# EAGLE design ramanPi_interfaceBoard (EAGLE 6.2)
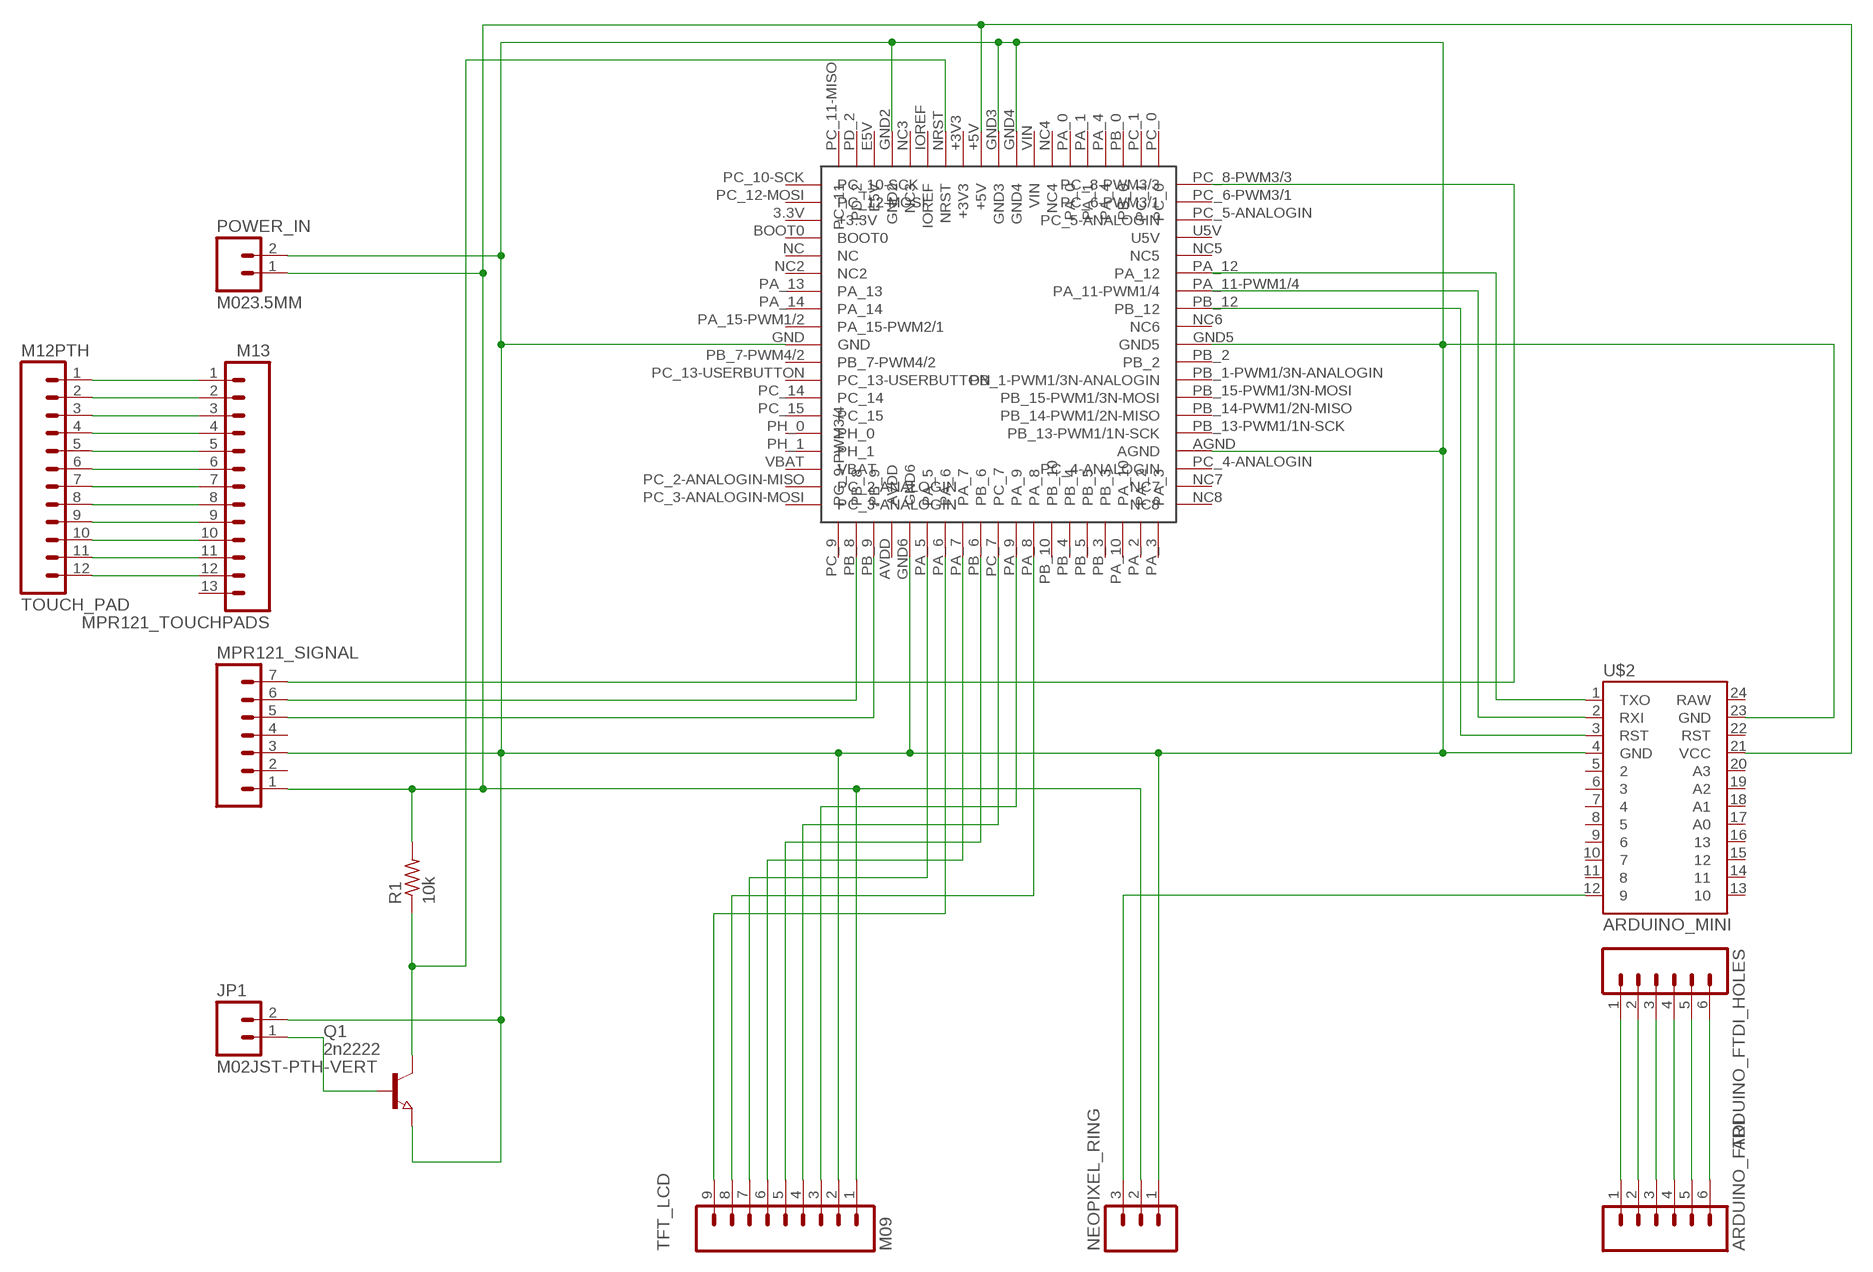
[diagram p0: schematic, sheet 1]

## Parts
ARDUINO_FTDI  M06SIP  [1X06]
ARDUINO_FTDI_HOLES  M06SIP  [1X06]
JP1  M02JST-PTH-VERT  [JST-2-PTH-VERT]
MPR121_SIGNAL  M07  [1X07]
MPR121_TOUCHPADS  M13  [1X13]
NEOPIXEL_RING  M03JST-PTH-VERT  [JST-3-PTH-VERT]
POWER_IN  M023.5MM  [SCREWTERMINAL-3.5MM-2]
Q1  2n2222  NPN-TRANSISTOR_SOT23  [SOT23]
R1  10k  R-US_M1206  [M1206]
TFT_LCD  M09  [1X09]
TOUCH_PAD  M12PTH  [1X12]
U$1  STNUCLEOF401RE  [F401-RE]
U$2  ARDUINO_MINI  [ARDUINO_MINI]

## Nets
+5V: MPR121_SIGNAL.1 NEOPIXEL_RING.2 POWER_IN.1 R1.2 TFT_LCD.1 U$1.+5V U$2.21(VCC)
GND: JP1.2 MPR121_SIGNAL.3 NEOPIXEL_RING.1 POWER_IN.2 Q1.2(E) TFT_LCD.2 U$1.AGND U$1.GND U$1.GND2 U$1.GND3 U$1.GND4 U$1.GND5 U$1.GND6 U$2.4(GND) U$2.23(GND)
N$2: MPR121_TOUCHPADS.1 TOUCH_PAD.1
N$3: MPR121_TOUCHPADS.2 TOUCH_PAD.2
N$4: MPR121_TOUCHPADS.3 TOUCH_PAD.3
N$5: MPR121_TOUCHPADS.4 TOUCH_PAD.4
N$6: MPR121_TOUCHPADS.5 TOUCH_PAD.5
N$7: MPR121_TOUCHPADS.6 TOUCH_PAD.6
N$8: MPR121_TOUCHPADS.7 TOUCH_PAD.7
N$9: MPR121_TOUCHPADS.8 TOUCH_PAD.8
N$10: MPR121_TOUCHPADS.9 TOUCH_PAD.9
N$11: MPR121_TOUCHPADS.10 TOUCH_PAD.10
N$12: MPR121_TOUCHPADS.11 TOUCH_PAD.11
N$13: MPR121_TOUCHPADS.12 TOUCH_PAD.12
N$14: NEOPIXEL_RING.3 U$2.12
N$15: MPR121_SIGNAL.7 U$1.PC_8-PWM3/3
N$16: MPR121_SIGNAL.5 U$1.PB_9
N$17: MPR121_SIGNAL.6 U$1.PB_8
N$18: ARDUINO_FTDI.1 ARDUINO_FTDI_HOLES.1
N$19: ARDUINO_FTDI.2 ARDUINO_FTDI_HOLES.2
N$20: ARDUINO_FTDI.3 ARDUINO_FTDI_HOLES.3
N$21: ARDUINO_FTDI.4 ARDUINO_FTDI_HOLES.4
N$22: ARDUINO_FTDI.5 ARDUINO_FTDI_HOLES.5
N$23: ARDUINO_FTDI.6 ARDUINO_FTDI_HOLES.6
N$24: TFT_LCD.3 U$1.PA_9
N$26: U$1.PA_12 U$2.1(TXO)
N$27: U$1.PA_11-PWM1/4 U$2.2(RXI)
N$28: U$1.PB_12 U$2.3(RST)
N$29: TFT_LCD.4 U$1.PC_7
N$30: TFT_LCD.5 U$1.PB_6
N$31: TFT_LCD.6 U$1.PA_7
N$32: TFT_LCD.7 U$1.PA_5
N$33: TFT_LCD.8 U$1.PA_8
N$34: TFT_LCD.9 U$1.PA_6
N$35: Q1.3(C) R1.1 U$1.NRST
N$36: JP1.1 Q1.1(B)
Unconnected: MPR121_SIGNAL.2 MPR121_SIGNAL.4 MPR121_TOUCHPADS.13 U$1.BOOT0 U$1.IOREF U$1.NC U$1.NC2 U$1.NC3 U$1.NC4 U$1.NC5 U$1.NC6 U$1.NC7 U$1.NC8 U$1.PA_0 U$1.PA_1 U$1.PA_2 U$1.PA_3 U$1.PA_4 U$1.PA_10 U$1.PA_13 U$1.PA_14 U$1.PA_15-PWM1/2(PA_15-PWM2/1) U$1.PB_0 U$1.PB_1-PWM1/3N-ANALOGIN U$1.PB_2 U$1.PB_3 U$1.PB_4 U$1.PB_5 U$1.PB_7-PWM4/2 U$1.PB_10 U$1.PB_13-PWM1/1N-SCK U$1.PB_14-PWM1/2N-MISO U$1.PB_15-PWM1/3N-MOSI U$1.PC_0 U$1.PC_1 U$1.PC_2-ANALOGIN-MISO(PC_2-ANALOGIN) U$1.PC_3-ANALOGIN-MOSI(PC_3-ANALOGIN) U$1.PC_4-ANALOGIN U$1.PC_5-ANALOGIN U$1.PC_6-PWM3/1 U$1.PC_9(PC_9-PWM3/4) U$1.PC_10-SCK U$1.PC_11-MISO(PC_11) U$1.PC_12-MOSI U$1.PC_13-USERBUTTON U$1.PC_14 U$1.PC_15 U$1.PD_2 U$1.PH_0 U$1.PH_1 U$2.5 U$2.6 U$2.7 U$2.8 U$2.9 U$2.10 U$2.11 U$2.13 U$2.14 U$2.15 U$2.16 U$2.17(A0) U$2.18(A1) U$2.19(A2) U$2.20(A3) U$2.22(RST) U$2.24(RAW)

## Power pins joined to a net without a drawn wire
+3.3V: U$1.3.3V(+3.3V)
+3V3: U$1.+3V3
AVDD: U$1.AVDD
E5V: U$1.E5V
U5V: U$1.U5V
VBAT: U$1.VBAT
VIN: U$1.VIN

## Library data of the parts
ARDUINO_FTDI ARDUINO_FTDI_HOLES = SparkFun-Connectors:M06: Header 6 Standard 6-pin 0.1" header. Use with straight break away headers (SKU : PRT-00116), right angle break away headers (PRT-00553), swiss pins (PRT-00743), machine pins (PRT-00117), and female headers (PRT-00115). Molex polarized connector foot print use with SKU : PRT-08094 with associated crimp pins and housings. NOTES ON THE VARIANTS LOCK and LOCK_LONGPADS... This footprint was designed to help hold the alignment of a through-hole component (i.e. 6-pin header) while soldering it into place. You may notice that each hole has been shifted either up or down by 0.005 of an inch from it's more standard position (which is a perfectly straight line). This slight alteration caused the pins (the squares in the middle) to touch the edges of the holes. Because they are alternating, it causes a "brace" to hold the component in place. 0.005 has proven to be the perfect amount of "off-center" position when using our standard breakaway headers. Although looks a little odd when you look at the bare footprint, once you have a header in there, the alteration is very hard to notice. Also,if you push a header all the way into place, it is covered up entirely on the bottom side. This idea of altering the position of holes to aid alignment will be further integrated into the Sparkfun Library for other footprints. It can help hold any component with 3 or more connection pins.
JP1 POWER_IN = SparkFun-Connectors:M02: Standard 2-pin 0.1" header. Use with - straight break away headers ( PRT-00116) - right angle break away headers (PRT-00553) - swiss pins (PRT-00743) - machine pins (PRT-00117) - female headers (PRT-00115) Molex polarized connector foot print use with: PRT-08233 with associated crimp pins and housings. 2.54_SCREWTERM for use with PRT-10571. 3.5mm Screw Terminal footprints for PRT-08084 5mm Screw Terminal footprints for use with PRT-08433
MPR121_SIGNAL = SparkFun-Connectors:M07: Header 7 Standard 7-pin 0.1" header. Use with straight break away headers (SKU : PRT-00116), right angle break away headers (PRT-00553), swiss pins (PRT-00743), machine pins (PRT-00117), and female headers (PRT-00115). NOTES ON THE VARIANTS LOCK and LOCK_LONGPADS... This footprint was designed to help hold the alignment of a through-hole component (i.e. 7-pin header) while soldering it into place. You may notice that each hole has been shifted either up or down by 0.005 of an inch from it's more standard position (which is usually a perfectly straight line). This slight alteration caused the pins (the squares in the middle) to touch the edges of the holes. Because they are alternating, it causes a "brace" to hold the header in place. 0.005 has proven to be the perfect amount of "off-center" position when using our standard breakaway headers. Although looks a little odd when you look at the bare footprint, once you have a header in there, the alteration is very hard to notice. Also, if you push a header all the way into place, it is covered up entirely on the bottom side. This idea of altering the position of holes to aid alignment will be further integrated into the Sparkfun Library for other footprints. It can help hold any component with 3 or more connection pins.
MPR121_TOUCHPADS = SparkFun-Connectors:M13: 13-pin single row .1" header
NEOPIXEL_RING = SparkFun-Connectors:M03: Header 3 Standard 3-pin 0.1" header. Use with straight break away headers (SKU : PRT-00116), right angle break away headers (PRT-00553), swiss pins (PRT-00743), machine pins (PRT-00117), and female headers (PRT-00115). Molex polarized connector foot print use with SKU : PRT-08232 with associated crimp pins and housings.
Q1 = semicon-smd-ipc:NPN-TRANSISTOR_: NPN TRANSISTOR
R1 = adafruit:R-US_: RESISTOR, American symbol
TFT_LCD = SparkFun-Connectors:M09: Header 9 Standard 9-pin 0.1" header. Use with straight break away headers (SKU : PRT-00116), right angle break away headers (PRT-00553), swiss pins (PRT-00743), machine pins (PRT-00117), and female headers (PRT-00115).
TOUCH_PAD = SparkFun-Connectors:M12: Header 12 Standard 12-pin 0.1" header. Use with straight break away headers (SKU : PRT-00116), right angle break away headers (PRT-00553), swiss pins (PRT-00743), machine pins (PRT-00117), and female headers (PRT-00115).
U$1 = nucleoF401RE:STNUCLEOF401RE
U$2 = SparkFun-Boards:ARDUINO_MINI: Arduino Pro Mini footprint

## Board
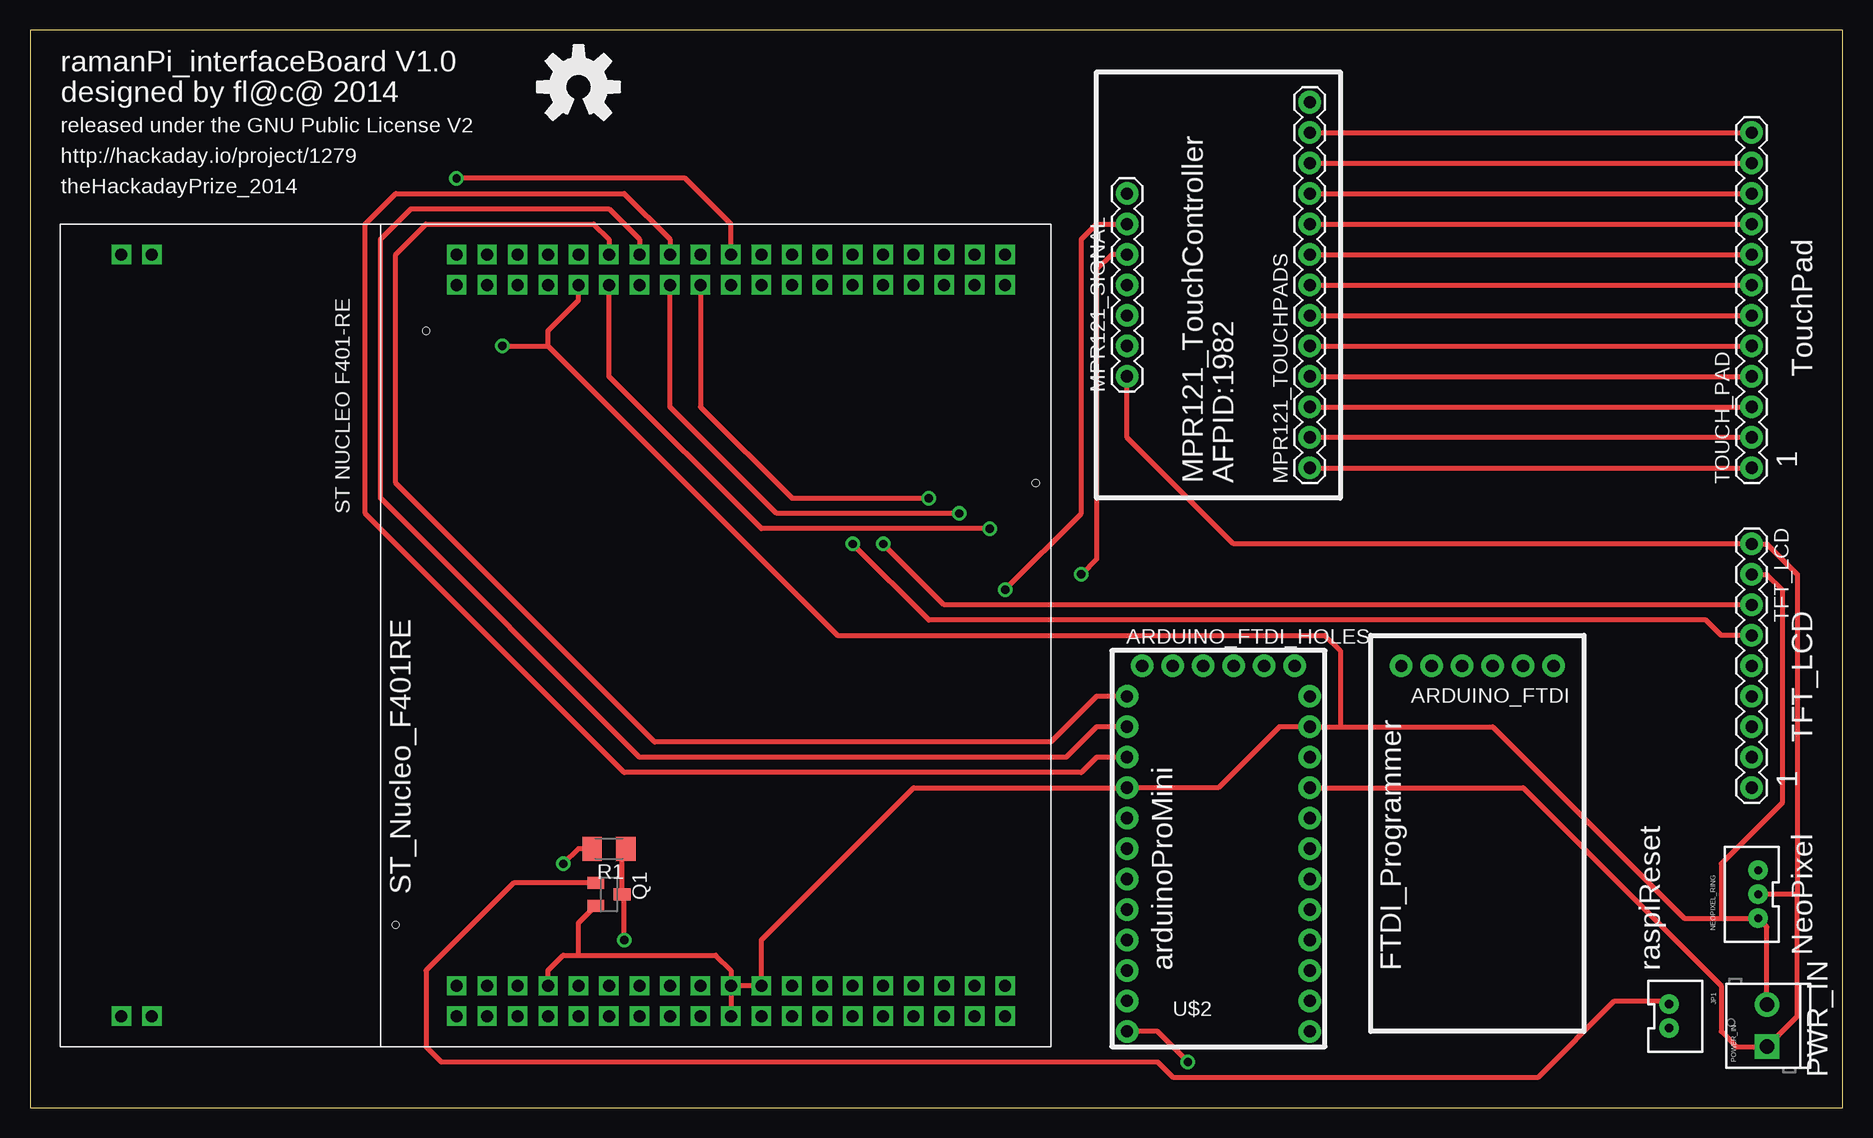
[diagram p1: board, top side]
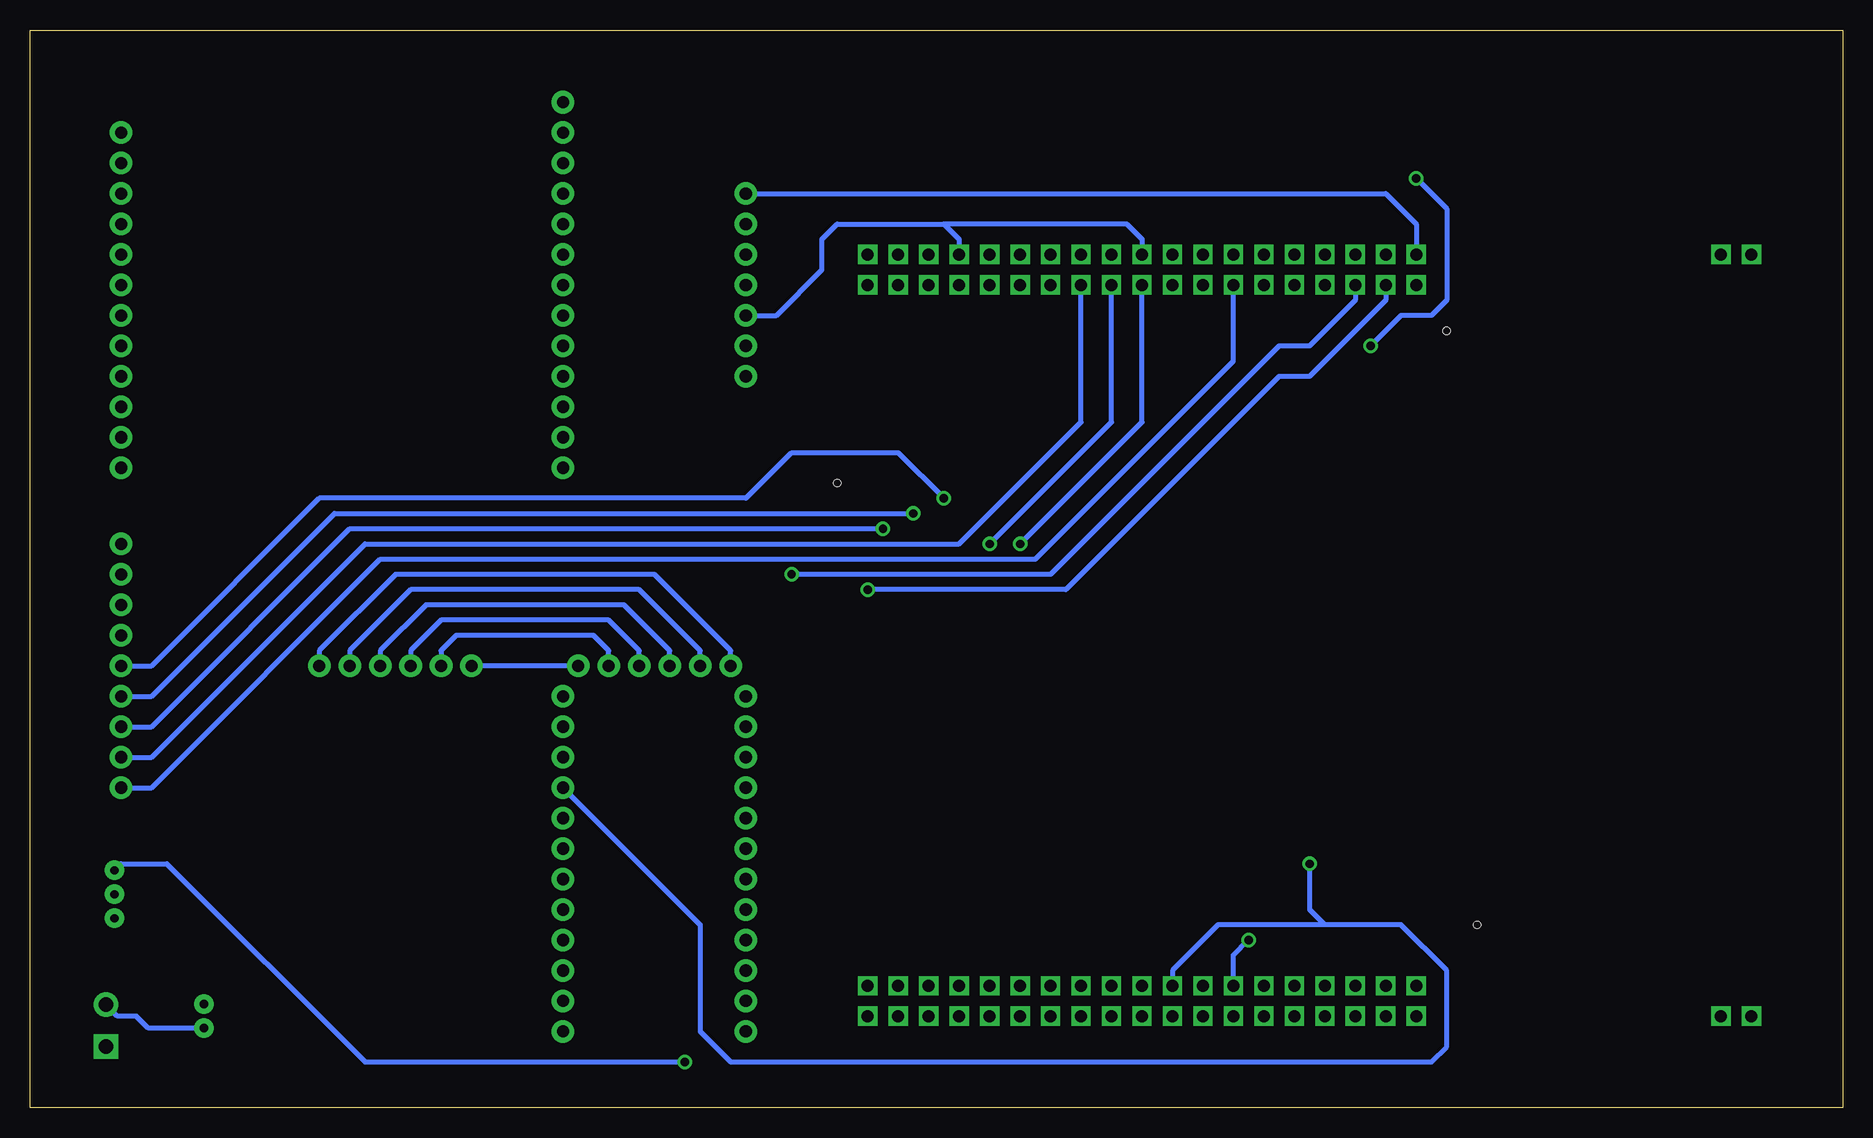
[diagram p2: board, bottom side, seen from below]

Size 151.11 x 89.84 mm. Coordinates in mm from the lower left corner, seen from the top.
Outline: 0,0 151.11,0 151.11,89.84 0,89.84 0,0
Copper layers (1*16): Top 0.035mm / dielectric 1.5mm / Bottom 0.035mm
Design rules: minimum track width 8mil, minimum drill 20mil, track to track 8mil, track to pad 8mil, pad to pad 8mil, via to via 8mil, smd to smd 8mil, copper to edge 10mil, drill to drill 8mil, minimum pad ring 12mil, minimum via ring 10mil, stop-mask expansion 4mil, vias tented up to drill 25mil, thermal gap 10mil

### Footprints (pad centres in the part's own frame; a part is rotated, then mirrored left to right if it is on the bottom)
1X06 = drill 1.016 pad 1.88: 1 0,0; 2 2.54,0; 3 5.08,0; 4 7.62,0; 5 10.16,0; 6 12.7,0
JST-2-PTH-VERT = drill 0.7 pad 1.626: 1 -1,-0.55; 2 1,-0.55
1X07 = drill 1.016 pad 1.88: 1 0,0; 2 2.54,0; 3 5.08,0; 4 7.62,0; 5 10.16,0; 6 12.7,0; 7 15.24,0
1X13 = drill 1.016 pad 1.88: 1 0,0; 2 2.54,0; 3 5.08,0; 4 7.62,0; 5 10.16,0; 6 12.7,0; 7 15.24,0; 8 17.78,0; 9 20.32,0; 10 22.86,0; 11 25.4,0; 12 27.94,0; 13 30.48,0
JST-3-PTH-VERT = drill 0.7 pad 1.626: 1 -2,-0.55; 2 0,-0.55; 3 2,-0.55
SCREWTERMINAL-3.5MM-2 = drill 1.2 pad 2.032 square: 1 0,0 | drill 1.2 pad 2.032: 2 3.5,0
SOT23 = smd 1 x 1.4: 1 -0.95,-1.1; 2 0.95,-1.1; 3 0,1.1
M1206 = smd 1.6 x 2: 1 -1.4,0; 2 1.4,0
1X09 = drill 1.016 pad 1.88: 1 0,0; 2 2.54,0; 3 5.08,0; 4 7.62,0; 5 10.16,0; 6 12.7,0; 7 15.24,0; 8 17.78,0; 9 20.32,0
1X12 = drill 1.016 pad 1.88: 1 0,0; 2 2.54,0; 3 5.08,0; 4 7.62,0; 5 10.16,0; 6 12.7,0; 7 15.24,0; 8 17.78,0; 9 20.32,0; 10 22.86,0; 11 25.4,0; 12 27.94,0
F401-RE = drill 1 square: 3.3V 2.54,44.45; +3V3 5.08,31.75; +5V 5.08,29.21; AGND 66.04,11.43; AVDD 63.5,41.91; BOOT0 2.54,41.91; E5V 5.08,44.45; GND 2.54,26.67; GND2 5.08,41.91; GND3 5.08,26.67; GND4 5.08,24.13; GND5 63.5,39.37; GND6 66.04,26.67; IOREF 5.08,36.83; NC 2.54,39.37; NC2 2.54,36.83; NC3 5.08,39.37; NC4 5.08,19.05; NC5 66.04,39.37; NC6 66.04,29.21; NC7 66.04,6.35; NC8 66.04,3.81; NRST 5.08,34.29; P$1 66.04,77.47; P$2 66.04,74.93; P$3 2.54,77.47; P$4 2.54,74.93; PA_0 5.08,16.51; PA_1 5.08,13.97; PA_2 63.5,6.35; PA_3 63.5,3.81; PA_4 5.08,11.43; PA_5 63.5,36.83; PA_6 63.5,34.29; PA_7 63.5,31.75; PA_8 63.5,21.59; PA_9 63.5,24.13; PA_10 63.5,8.89; PA_11-PWM1/4 66.04,34.29; PA_12 66.04,36.83; PA_13 2.54,34.29; PA_14 2.54,31.75; PA_15-PWM1/2 2.54,29.21; PB_0 5.08,8.89; PB_1-PWM1/3N-ANALOGIN 66.04,21.59; PB_2 66.04,24.13; PB_3 63.5,11.43; PB_4 63.5,16.51; PB_5 63.5,13.97; PB_6 63.5,29.21; PB_7-PWM4/2 2.54,24.13; PB_8 63.5,46.99; PB_9 63.5,44.45; PB_10 63.5,19.05; PB_12 66.04,31.75; PB_13-PWM1/1N-SCK 66.04,13.97; PB_14-PWM1/2N-MISO 66.04,16.51; PB_15-PWM1/3N-MOSI 66.04,19.05; PC_0 5.08,3.81; PC_1 5.08,6.35; PC_2-ANALOGIN-MISO 2.54,6.35; PC_3-ANALOGIN-MOSI 2.54,3.81; PC_4-ANALOGIN 66.04,8.89; PC_5-ANALOGIN 66.04,44.45; PC_6-PWM3/1 66.04,46.99; PC_7 63.5,26.67; PC_8-PWM3/3 66.04,49.53; PC_9 63.5,49.53; PC_10-SCK 2.54,49.53; PC_11-MISO 5.08,49.53; PC_12-MOSI 2.54,46.99; PC_13-USERBUTTON 2.54,21.59; PC_14 2.54,19.05; PC_15 2.54,16.51; PD_2 5.08,46.99; PH_0 2.54,13.97; PH_1 2.54,11.43; U5V 66.04,41.91; VBAT 2.54,8.89; VIN 5.08,21.59 | hole 0.6: 46.99,1.27; 10.16,54.61; 59.69,52.07
ARDUINO_MINI = drill 1.016 pad 1.88: 1 -7.62,12.7; 2 -7.62,10.16; 3 -7.62,7.62; 4 -7.62,5.08; 5 -7.62,2.54; 6 -7.62,0; 7 -7.62,-2.54; 8 -7.62,-5.08; 9 -7.62,-7.62; 10 -7.62,-10.16; 11 -7.62,-12.7; 12 -7.62,-15.24; 13 7.62,-15.24; 14 7.62,-12.7; 15 7.62,-10.16; 16 7.62,-7.62; 17 7.62,-5.08; 18 7.62,-2.54; 19 7.62,0; 20 7.62,2.54; 21 7.62,5.08; 22 7.62,7.62; 23 7.62,10.16; 24 7.62,12.7

### Placement (x,y rotation side)
ARDUINO_FTDI  127,36.83 180 top
ARDUINO_FTDI_HOLES  92.71,36.83 0 top
JP1  137.16,7.62 270 top
MPR121_SIGNAL  91.44,60.96 90 top
MPR121_TOUCHPADS  106.68,53.34 90 top
NEOPIXEL_RING  143.51,17.78 90 top
POWER_IN  144.78,5.08 90 top
Q1  48.26,17.78 270 top
R1  48.26,21.59 180 top
TFT_LCD  143.51,46.99 270 top
TOUCH_PAD  143.51,53.34 90 top
U$1  85.09,5.08 90 top
U$2  99.06,21.59 0 top
U$3  [OSHW-LOGO-L]  45.72,85.09 0 top

### Tracks (layer width: path | path; a pad name or v marks a point on that pad's centre or on a via)
+5V  (via drill 0.7)
  Top 0.406: MPR121_SIGNAL.1 91.44,55.88 100.33,46.99 TFT_LCD.1 144.78,46.99 147.32,44.45 147.32,17.78 | 147.32,17.78 147.32,7.62 POWER_IN.1 142.24,5.08 140.97,6.35 140.97,10.16 124.46,26.67 U$2.21 | 147.32,17.78 NEOPIXEL_RING.2 | R1.2 45.72,21.59 v44.45,20.32
  Bottom 0.406: U$2.21 95.25,15.24 95.25,6.35 92.71,3.81 34.29,3.81 33.02,5.08 33.02,11.43 36.83,15.24 43.18,15.24 | 43.18,15.24 52.07,15.24 55.88,11.43 U$1.+5V | v44.45,20.32 44.45,16.51 43.18,15.24
GND  (via drill 0.7)
  Top 0.406: 109.22,31.75 U$2.23 104.14,31.75 99.06,26.67 U$2.4 73.66,26.67 60.96,13.97 U$1.GND4 U$1.GND3 | 109.22,31.75 121.92,31.75 137.89,15.78 140.97,15.78 | 140.97,15.78 NEOPIXEL_RING.1 144.78,15.06 POWER_IN.2 | TFT_LCD.2 144.78,44.45 146.05,43.18 146.05,25.4 140.97,20.32 140.97,15.78 | U$1.GND3 U$1.GND | 45.72,12.7 57.15,12.7 58.42,11.43 U$1.GND3 | 43.18,63.5 67.31,39.37 107.95,39.37 109.22,38.1 109.22,31.75 | U$1.GND6 58.42,73.66 54.61,77.47 v35.56,77.47 | v39.37,63.5 43.18,63.5 | 43.18,63.5 43.18,64.77 45.72,67.31 U$1.GND5 | U$1.GND2 43.18,11.43 44.45,12.7 45.72,12.7 | 45.72,12.7 45.72,15.39 Q1.2
  Bottom 0.406: MPR121_SIGNAL.3 88.9,66.04 85.09,69.85 85.09,72.39 83.82,73.66 74.93,73.66 | 74.93,73.66 73.66,72.39 U$1.AGND | 74.93,73.66 59.69,73.66 58.42,72.39 U$1.GND6 | v35.56,77.47 33.02,74.93 33.02,67.31 34.29,66.04 36.83,66.04 v39.37,63.5 | JP1.2 141.24,6.62 142.24,7.62 143.82,7.62 POWER_IN.2
N$2
  Top 0.406: MPR121_TOUCHPADS.1 TOUCH_PAD.1
N$3
  Top 0.406: TOUCH_PAD.2 MPR121_TOUCHPADS.2
N$4
  Top 0.406: MPR121_TOUCHPADS.3 TOUCH_PAD.3
N$5
  Top 0.406: MPR121_TOUCHPADS.4 TOUCH_PAD.4
N$6
  Top 0.406: MPR121_TOUCHPADS.5 TOUCH_PAD.5
N$7
  Top 0.406: MPR121_TOUCHPADS.6 TOUCH_PAD.6
N$8
  Top 0.406: MPR121_TOUCHPADS.7 TOUCH_PAD.7
N$9
  Top 0.406: MPR121_TOUCHPADS.8 TOUCH_PAD.8
N$10
  Top 0.406: MPR121_TOUCHPADS.9 TOUCH_PAD.9
N$11
  Top 0.406: MPR121_TOUCHPADS.10 TOUCH_PAD.10
N$12
  Top 0.406: MPR121_TOUCHPADS.11 TOUCH_PAD.11
N$13
  Top 0.406: MPR121_TOUCHPADS.12 TOUCH_PAD.12
N$14  (via drill 0.7)
  Top 0.406: v96.52,3.81 93.98,6.35 U$2.12
  Bottom 0.406: NEOPIXEL_RING.3 143.52,20.32 139.7,20.32 123.19,3.81 v96.52,3.81
N$15
  Bottom 0.406: MPR121_SIGNAL.7 38.1,76.2 35.56,73.66 U$1.PC_8-PWM3/3
N$16  (via drill 0.7)
  Top 0.406: MPR121_SIGNAL.5 90.17,71.12 88.9,69.85 88.9,45.72 v87.63,44.45
  Bottom 0.406: U$1.PB_9 40.64,67.31 44.45,63.5 46.99,63.5 66.04,44.45 v87.63,44.45
N$17  (via drill 0.7)
  Top 0.406: v81.28,43.18 87.63,49.53 87.63,72.39 88.9,73.66 MPR121_SIGNAL.6
  Bottom 0.406: U$1.PB_8 38.1,67.31 44.45,60.96 46.99,60.96 64.77,43.18 v81.28,43.18
N$18
  Bottom 0.406: ARDUINO_FTDI_HOLES.1 92.71,38.1 99.06,44.45 120.65,44.45 127,38.1 ARDUINO_FTDI.1
N$19
  Bottom 0.406: ARDUINO_FTDI_HOLES.2 95.25,38.1 100.33,43.18 119.38,43.18 124.46,38.1 ARDUINO_FTDI.2
N$20
  Bottom 0.406: ARDUINO_FTDI_HOLES.3 97.79,38.1 101.6,41.91 118.11,41.91 121.92,38.1 ARDUINO_FTDI.3
N$21
  Bottom 0.406: ARDUINO_FTDI_HOLES.4 100.33,38.1 102.87,40.64 116.84,40.64 119.38,38.1 ARDUINO_FTDI.4
N$22
  Bottom 0.406: ARDUINO_FTDI_HOLES.5 102.87,38.1 104.14,39.37 115.57,39.37 116.84,38.1 ARDUINO_FTDI.5
N$23
  Bottom 0.406: ARDUINO_FTDI_HOLES.6 ARDUINO_FTDI.6
N$24  (via drill 0.7)
  Top 0.406: TFT_LCD.3 76.2,41.91 v71.12,46.99
  Bottom 0.406: v71.12,46.99 60.96,57.15 U$1.PA_9
N$26
  Top 0.406: U$2.1 88.9,34.29 85.09,30.48 52.07,30.48 30.48,52.07 30.48,71.12 33.02,73.66 46.99,73.66 48.26,72.39 U$1.PA_12
N$27
  Top 0.406: U$2.2 88.9,31.75 86.36,29.21 50.8,29.21 29.21,50.8 29.21,72.39 31.75,74.93 48.26,74.93 50.8,72.39 U$1.PA_11-PWM1/4
N$28
  Top 0.406: U$2.3 88.9,29.21 87.63,27.94 49.53,27.94 27.94,49.53 27.94,73.66 30.48,76.2 49.53,76.2 53.34,72.39 U$1.PB_12
N$29  (via drill 0.7)
  Top 0.406: TFT_LCD.4 140.97,39.37 139.7,40.64 74.93,40.64 v68.58,46.99
  Bottom 0.406: v68.58,46.99 58.42,57.15 U$1.PC_7
N$30  (via drill 0.7)
  Top 0.406: U$1.PB_6 55.88,58.42 63.5,50.8 v74.93,50.8
  Bottom 0.406: TFT_LCD.5 140.97,36.83 127,50.8 91.44,50.8 87.63,54.61 78.74,54.61 v74.93,50.8
N$31  (via drill 0.7)
  Top 0.406: v77.47,49.53 62.23,49.53 53.34,58.42 U$1.PA_7
  Bottom 0.406: TFT_LCD.6 140.97,34.29 125.73,49.53 v77.47,49.53
N$32  (via drill 0.7)
  Top 0.406: v80.01,48.26 60.96,48.26 48.26,60.96 U$1.PA_5
  Bottom 0.406: TFT_LCD.7 140.97,31.75 124.46,48.26 v80.01,48.26
N$33
  Bottom 0.406: TFT_LCD.8 140.97,29.21 123.19,46.99 73.66,46.99 63.5,57.15 U$1.PA_8
N$34
  Bottom 0.406: TFT_LCD.9 140.97,26.67 121.92,45.72 67.31,45.72 50.8,62.23 U$1.PA_6
N$35  (via drill 0.7)
  Top 0.406: v49.53,13.97 49.53,17.61 Q1.3 49.36,21.29 R1.1
  Bottom 0.406: U$1.NRST 50.8,12.7 v49.53,13.97
N$36
  Top 0.406: Q1.1 40.32,18.73 33.02,11.43 33.02,5.08 34.29,3.81 93.98,3.81 95.25,2.54 125.73,2.54 132.08,8.89 136.34,8.89 JP1.1

### Text on the board
tPlace: ramanPi_interfaceBoard V1.0 | designed by fl@c@ 2014 | released under the GNU Public License V2 | http://hackaday.io/project/1279 | theHackadayPrize_2014 | TouchPad | 1 | MPR121_TouchController | AFPID:1982 | TFT_LCD | 1 | ST_Nucleo_F401RE | NeoPixel | arduinoProMini | FTDI_Programmer | raspiReset | PWR_IN